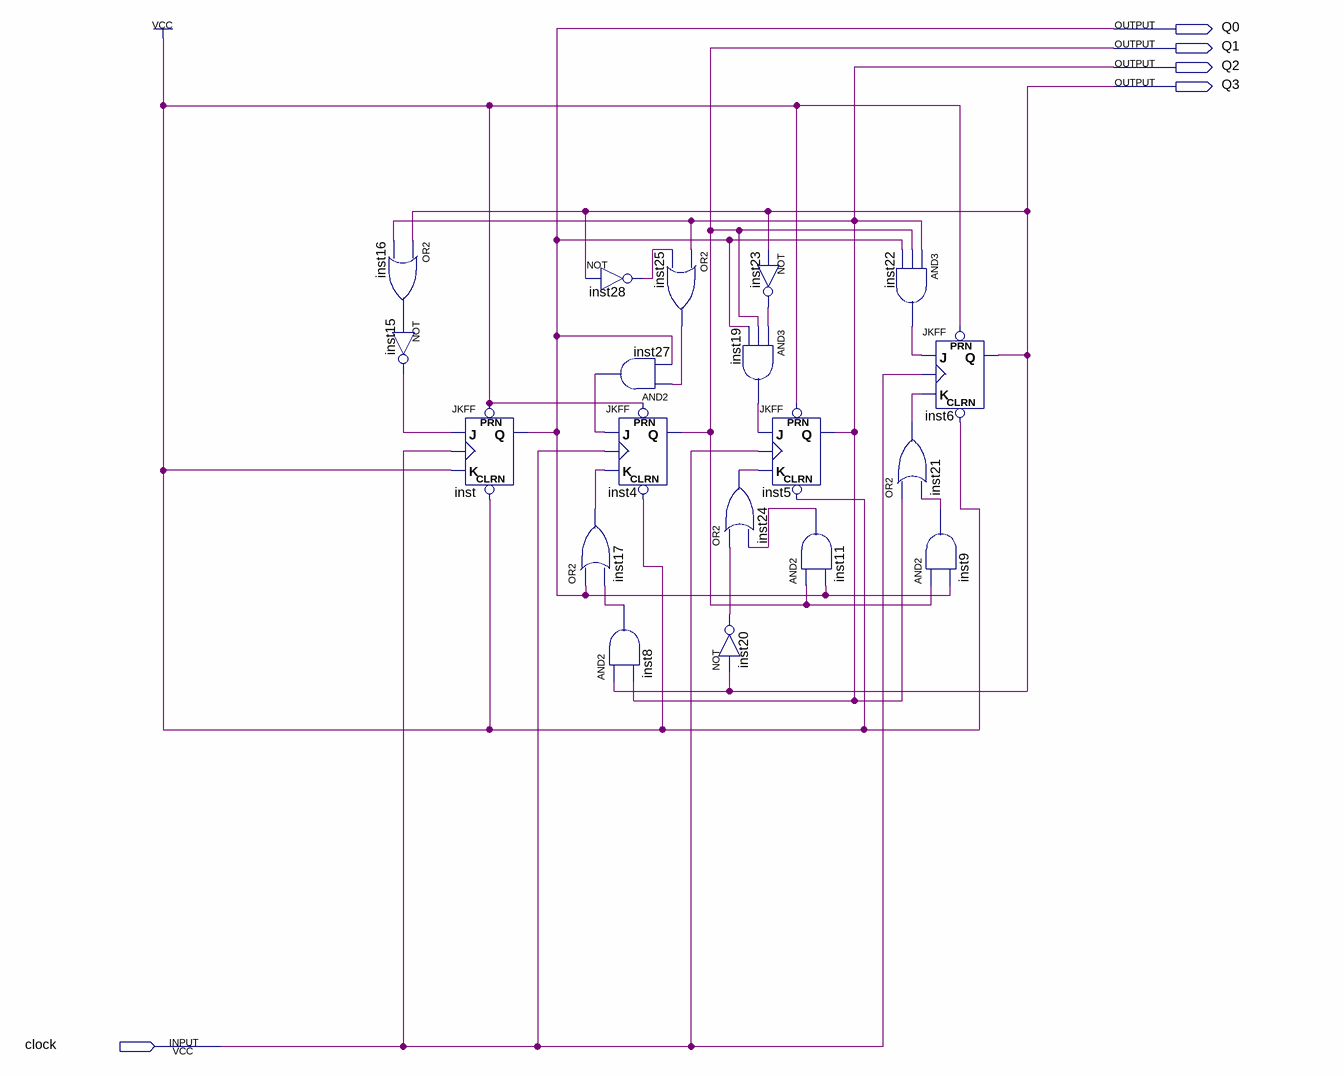
[diagram p0: schematic sheet]
// Quartus schematic sync_contermod11.bdf as structural Verilog: 19 symbols, 5 pins
module sync_contermod11 (
  input  clock,
  output Q0,
  output Q1,
  output Q2,
  output Q3
);

  wire inst8_out, inst9_out, inst11_out, inst15_out, inst16_out, inst17_out, inst19_out, inst20_out,
       inst21_out, inst22_out, inst23_out, inst24_out, inst25_out, inst27_out, inst28_out;

  or inst16 (inst16_out, Q3, Q2);
  not inst15 (inst15_out, inst16_out);
  JKFF inst (.PRN(1'b1), .CLRN(1'b1), .K(1'b1), .J(inst15_out), .CLK(clock), .Q(Q0));
  not inst28 (inst28_out, Q3);
  or inst17 (inst17_out, Q0, inst8_out);
  or inst25 (inst25_out, Q2, inst28_out);
  and inst27 (inst27_out, inst25_out, Q0);
  JKFF inst4 (.PRN(1'b1), .CLRN(1'b1), .K(inst17_out), .J(inst27_out), .CLK(clock), .Q(Q1));
  and inst8 (inst8_out, Q3, Q2);
  and inst19 (inst19_out, inst23_out, Q1, Q0);
  or inst24 (inst24_out, inst20_out, inst11_out);
  not inst20 (inst20_out, Q3);
  not inst23 (inst23_out, Q3);
  JKFF inst5 (.PRN(1'b1), .CLRN(1'b1), .K(inst24_out), .J(inst19_out), .CLK(clock), .Q(Q2));
  and inst11 (inst11_out, Q1, Q0);
  and inst22 (inst22_out, Q2, Q1, Q0);
  or inst21 (inst21_out, Q2, inst9_out);
  JKFF inst6 (.PRN(1'b1), .CLRN(1'b1), .K(inst21_out), .J(inst22_out), .CLK(clock), .Q(Q3));
  and inst9 (inst9_out, Q1, Q0);
endmodule
